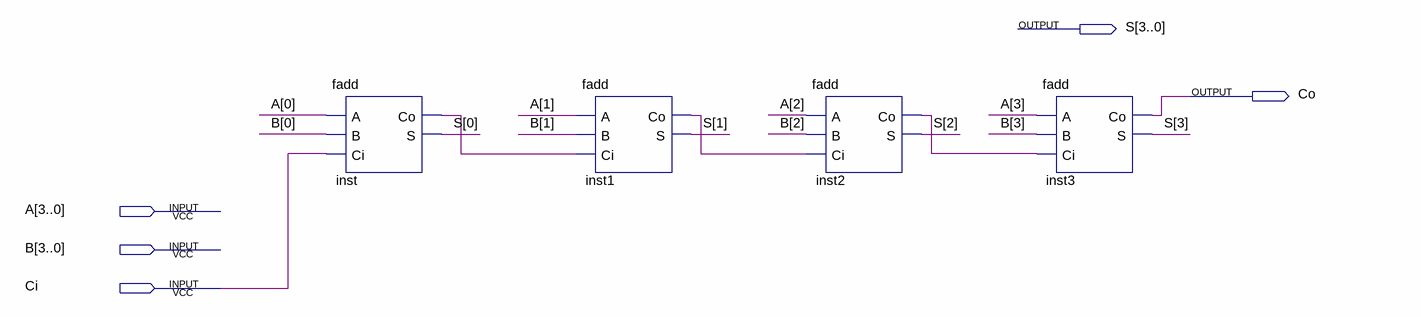
[diagram p0: schematic sheet]
// Quartus schematic adder.bdf as structural Verilog: 4 symbols, 5 pins
module adder (
  input  [3:0] A,
  input  [3:0] B,
  input  Ci,
  output [3:0] S,
  output Co
);

  wire inst1_co, inst2_co, inst_co;

  fadd inst (.A(A[0]), .B(B[0]), .Ci(Ci), .Co(inst_co), .S(S[0]));
  fadd inst1 (.A(A[1]), .B(B[1]), .Ci(inst_co), .Co(inst1_co), .S(S[1]));
  fadd inst2 (.A(A[2]), .B(B[2]), .Ci(inst1_co), .Co(inst2_co), .S(S[2]));
  fadd inst3 (.A(A[3]), .B(B[3]), .Ci(inst2_co), .Co(Co), .S(S[3]));
endmodule
